# Altium schematic sheet eth.SchDoc
size A3
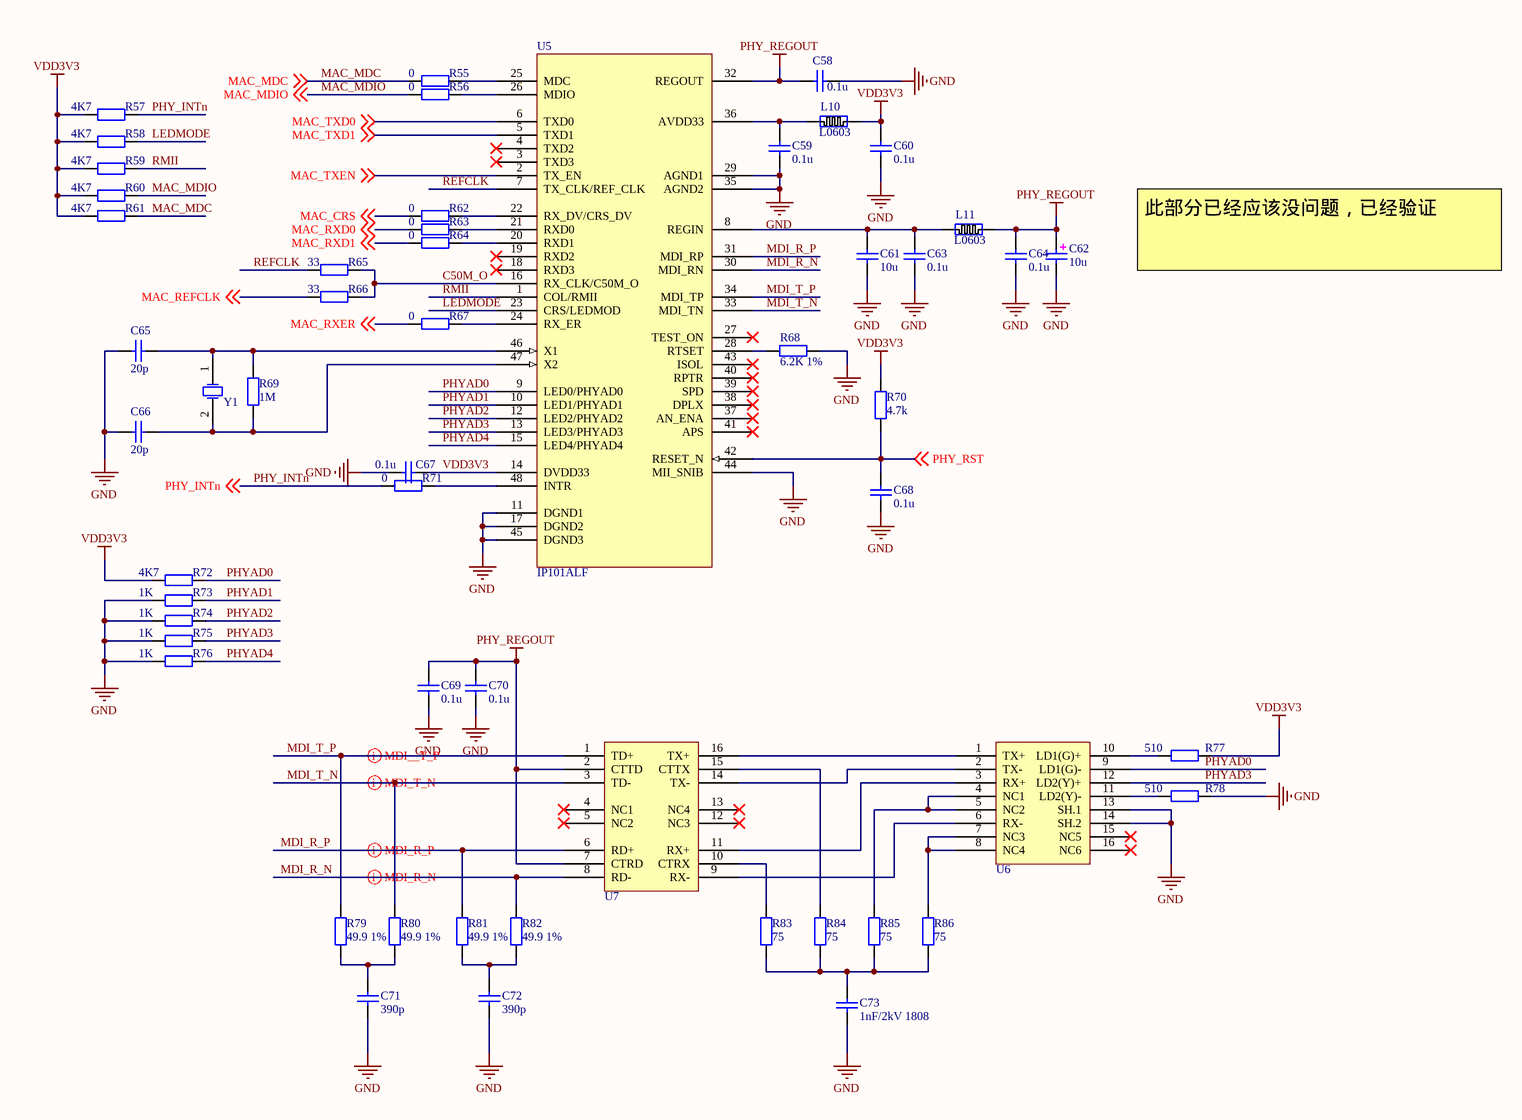
[diagram p0: eth.SchDoc]

## Parts
C58  0.1u  [C0603]
C59  0.1u  [C0603]
C60  0.1u  [C0603]
C61  10u  [C0603]
C62  10u  [C1210]
C63  0.1u  [C0603]
C64  0.1u  [C0603]
C65  20p  [C0603]
C66  20p  [C0603]
C67  0.1u  [C0603]
C68  0.1u  [C0603]
C69  0.1u  [C0603]
C70  0.1u  [C0603]
C71  390p  [C0603]
C72  390p  [C0603]
C73  1nF/2kV 1808  [C1808]
L10  L0603  [L0603]
L11  L0603  [L0603]
R55  0  [R0603]
R56  0  [R0603]
R57  4K7  [R0603]
R58  4K7  [R0603]
R59  4K7  [R0603]
R60  4K7  [R0603]
R61  4K7  [R0603]
R62  0  [R0603]
R63  0  [R0603]
R64  0  [R0603]
R65  33  [R0603]
R66  33  [R0603]
R67  0  [R0603]
R68  6.2K 1%  [R0603]
R69  1M  [R0603]
R70  4.7k  [R0603]
R71  0  [R0603]
R72  4K7  [R0603]
R73  1K  [R0603]
R74  1K  [R0603]
R75  1K  [R0603]
R76  1K  [R0603]
R77  510  [R0603]
R78  510  [R0603]
R79  49.9 1%  [R0603]
R80  49.9 1%  [R0603]
R81  49.9 1%  [R0603]
R82  49.9 1%  [R0603]
R83  75  [R0603]
R84  75  [R0603]
R85  75  [R0603]
R86  75  [R0603]
U5  IP101ALF  [P48LQFP]
U6  48146-0010  [RJ45_1X1L_20U]  (value not drawn)
U7  TS6121C  [TS6121C]  (value not drawn)
Y1  XTAL  [XTAL-SMD-LP]  (value not drawn)

## Nets
GND: C58.1 C59.1 C60.1 C61.1 C62.2 C63.1 C64.1 C65.1 C66.1 C67.1 C68.1 C69.1 C70.1 C71.1 C72.1 C73.1 R68.2 R73.1 R74.1 R75.1 R76.1 R78.1 U5.11(DGND1) U5.17(DGND2) U5.29(AGND1) U5.35(AGND2) U5.44(MII_SNIB) U5.45(DGND3) U6.13(SH.1) U6.14(SH.2)
PHY_REGOUT: C58.2 C62.1 C64.2 C69.2 C70.2 L11.2 U5.32(REGOUT) U7.2(CTTD) U7.7(CTRD)
VDD3V3: C60.2 C67.2 L10.2 R57.1 R58.1 R59.1 R60.1 R61.1 R70.2 R72.1 R77.1 U5.14(DVDD33)
C50M_O: R65.2 R66.2 U5.16(RX_CLK/C50M_O)
LEDMODE: R58.2 U5.23(CRS/LEDMOD)
MAC_CRS: R62.1 ; off-sheet MAC_CRS
MAC_MDC: R55.1 R61.2 ; off-sheet MAC_MDC
MAC_MDIO: R56.1 R60.2 ; off-sheet MAC_MDIO
MAC_REFCLK: R66.1 ; off-sheet MAC_REFCLK
MAC_RXD0: R63.1 ; off-sheet MAC_RXD0
MAC_RXD1: R64.1 ; off-sheet MAC_RXD1
MAC_RXER: R67.1 ; off-sheet MAC_RXER
MAC_TXD0: U5.6(TXD0) ; off-sheet MAC_TXD0
MAC_TXD1: U5.5(TXD1) ; off-sheet MAC_TXD1
MAC_TXEN: U5.2(TX_EN) ; off-sheet MAC_TXEN
MDI_R_N: R82.2 U5.30(MDI_RN) U7.8(RD-)
MDI_R_P: R81.2 U5.31(MDI_RP) U7.6(RD+)
MDI_T_N: R80.2 U5.33(MDI_TN) U7.3(TD-)
MDI_T_P: R79.2 U5.34(MDI_TP) U7.1(TD+)
PHY_INTn: R57.2 R71.1 ; off-sheet PHY_INTn
PHY_RST: C68.2 R70.1 U5.42(RESET_N) ; off-sheet PHY_RST
PHYAD0: R72.2 U5.9(LED0/PHYAD0) U6.9(LD1(G)-)
PHYAD1: R73.2 U5.10(LED1/PHYAD1)
PHYAD2: R74.2 U5.12(LED2/PHYAD2)
PHYAD3: R75.2 U5.13(LED3/PHYAD3) U6.12(LD2(Y)+)
PHYAD4: R76.2 U5.15(LED4/PHYAD4)
REFCLK: R65.1 U5.7(TX_CLK/REF_CLK)
RMII: R59.2 U5.1(COL/RMII)
NetC59_2: C59.2 L10.1 U5.36(AVDD33)
NetC61_2: C61.2 C63.2 L11.1 U5.8(REGIN)
NetC65_2: C65.2 R69.2 U5.46(X1) Y1.1(OSC1)
NetC66_2: C66.2 R69.1 U5.47(X2) Y1.2(OSC2)
NetC71_2: C71.2 R79.1 R80.1
NetC72_2: C72.2 R81.1 R82.1
NetC73_2: C73.2 R83.1 R84.1 R85.1 R86.1
NetR55_2: R55.2 U5.25(MDC)
NetR56_2: R56.2 U5.26(MDIO)
NetR62_2: R62.2 U5.22(RX_DV/CRS_DV)
NetR63_2: R63.2 U5.21(RXD0)
NetR64_2: R64.2 U5.20(RXD1)
NetR67_2: R67.2 U5.24(RX_ER)
NetR68_1: R68.1 U5.28(RTSET)
NetR71_2: R71.2 U5.48(INTR)
NetR77_2: R77.2 U6.10(LD1(G)+)
NetR78_2: R78.2 U6.11(LD2(Y)-)
NetR83_2: R83.2 U7.10(CTRX)
NetR84_2: R84.2 U7.15(CTTX)
NetR85_2: R85.2 U6.4(NC1) U6.5(NC2)
NetR86_2: R86.2 U6.7(NC3) U6.8(NC4)
NetU6_1: U6.1(TX+) U7.16(TX+)
NetU6_2: U6.2(TX-) U7.14(TX-)
NetU6_3: U6.3(RX+) U7.11(RX+)
NetU6_6: U6.6(RX-) U7.9(RX-)

Not connected (* = marked no-connect by the designer): U5 3(TXD3)* 4(TXD2)* 18(RXD3)* 19(RXD2)* 27(TEST_ON)* 37(AN_ENA)* 38(DPLX)* 39(SPD)* 40(RPTR)* 41(APS)* 43(ISOL)*; U6 15(NC5)* 16(NC6)*; U7 4(NC1)* 5(NC2)* 12(NC3)* 13(NC4)*

## Layout directives
differential pair: MDI_R_N, MDI_R_P, MDI_T_N, MDI_T_P

## Notes on the sheet
- 此部分已经应该没问题，已经验证

## Library data of the parts
C58-C61 C63-C73 = CAP0603: 0603 Capacitor without Polarity
C62 = DCAP: 钽电容1210封装
L10 L11 = L0603: 0603 Inductor
R55-R86 = RES0603: 0603 Resistor
U6 = 48146-0010: 10/100Mbps ethernet RJ45 with LEDs
U7 = TS6121C: 10/100Mbps Transformer
Y1 = XTAL: 2Pin晶振